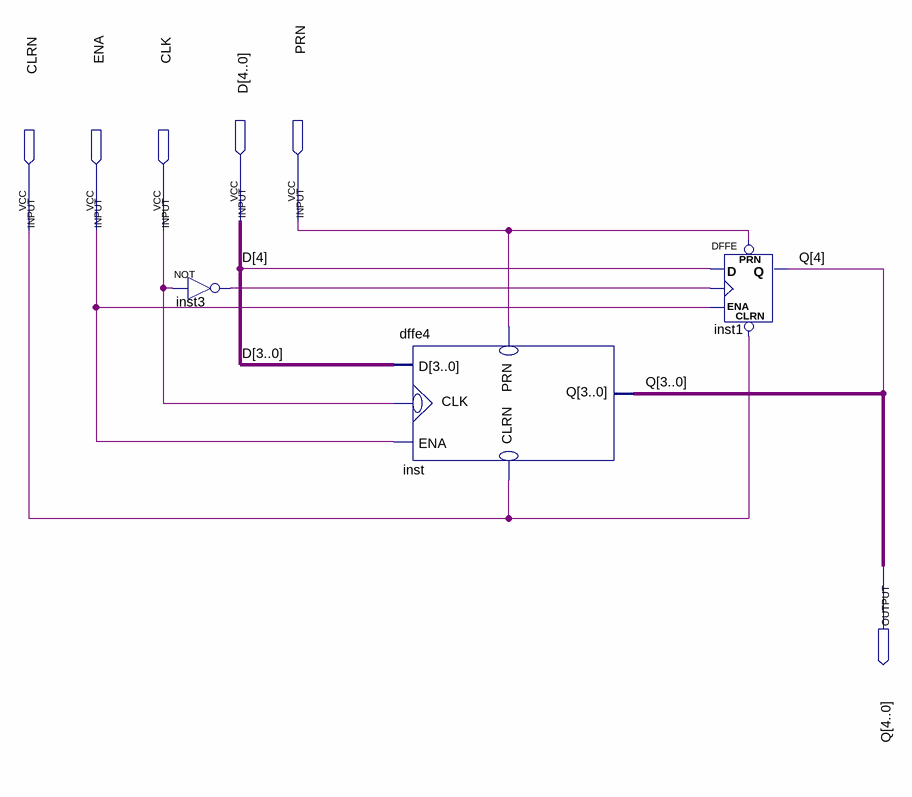
[diagram p0: schematic sheet]
// Quartus schematic dffe5.bdf as structural Verilog: 3 symbols, 6 pins
module dffe5 (
  input  [4:0] D,
  input  PRN,
  input  CLRN,
  input  ENA,
  input  CLK,
  output [4:0] Q
);

  wire inst3_out;

  not inst3 (inst3_out, CLK);
  dffe4 inst (.ENA(ENA), .CLRN(CLRN), .PRN(PRN), .D(D[3:0]), .CLK(CLK), .Q(Q[3:0]));
  DFFE inst1 (.PRN(PRN), .CLRN(CLRN), .D(D[4]), .CLK(inst3_out), .ENA(ENA), .Q(Q[4]));
endmodule
